# EAGLE design MSP part PCB new (EAGLE 8.6.0)
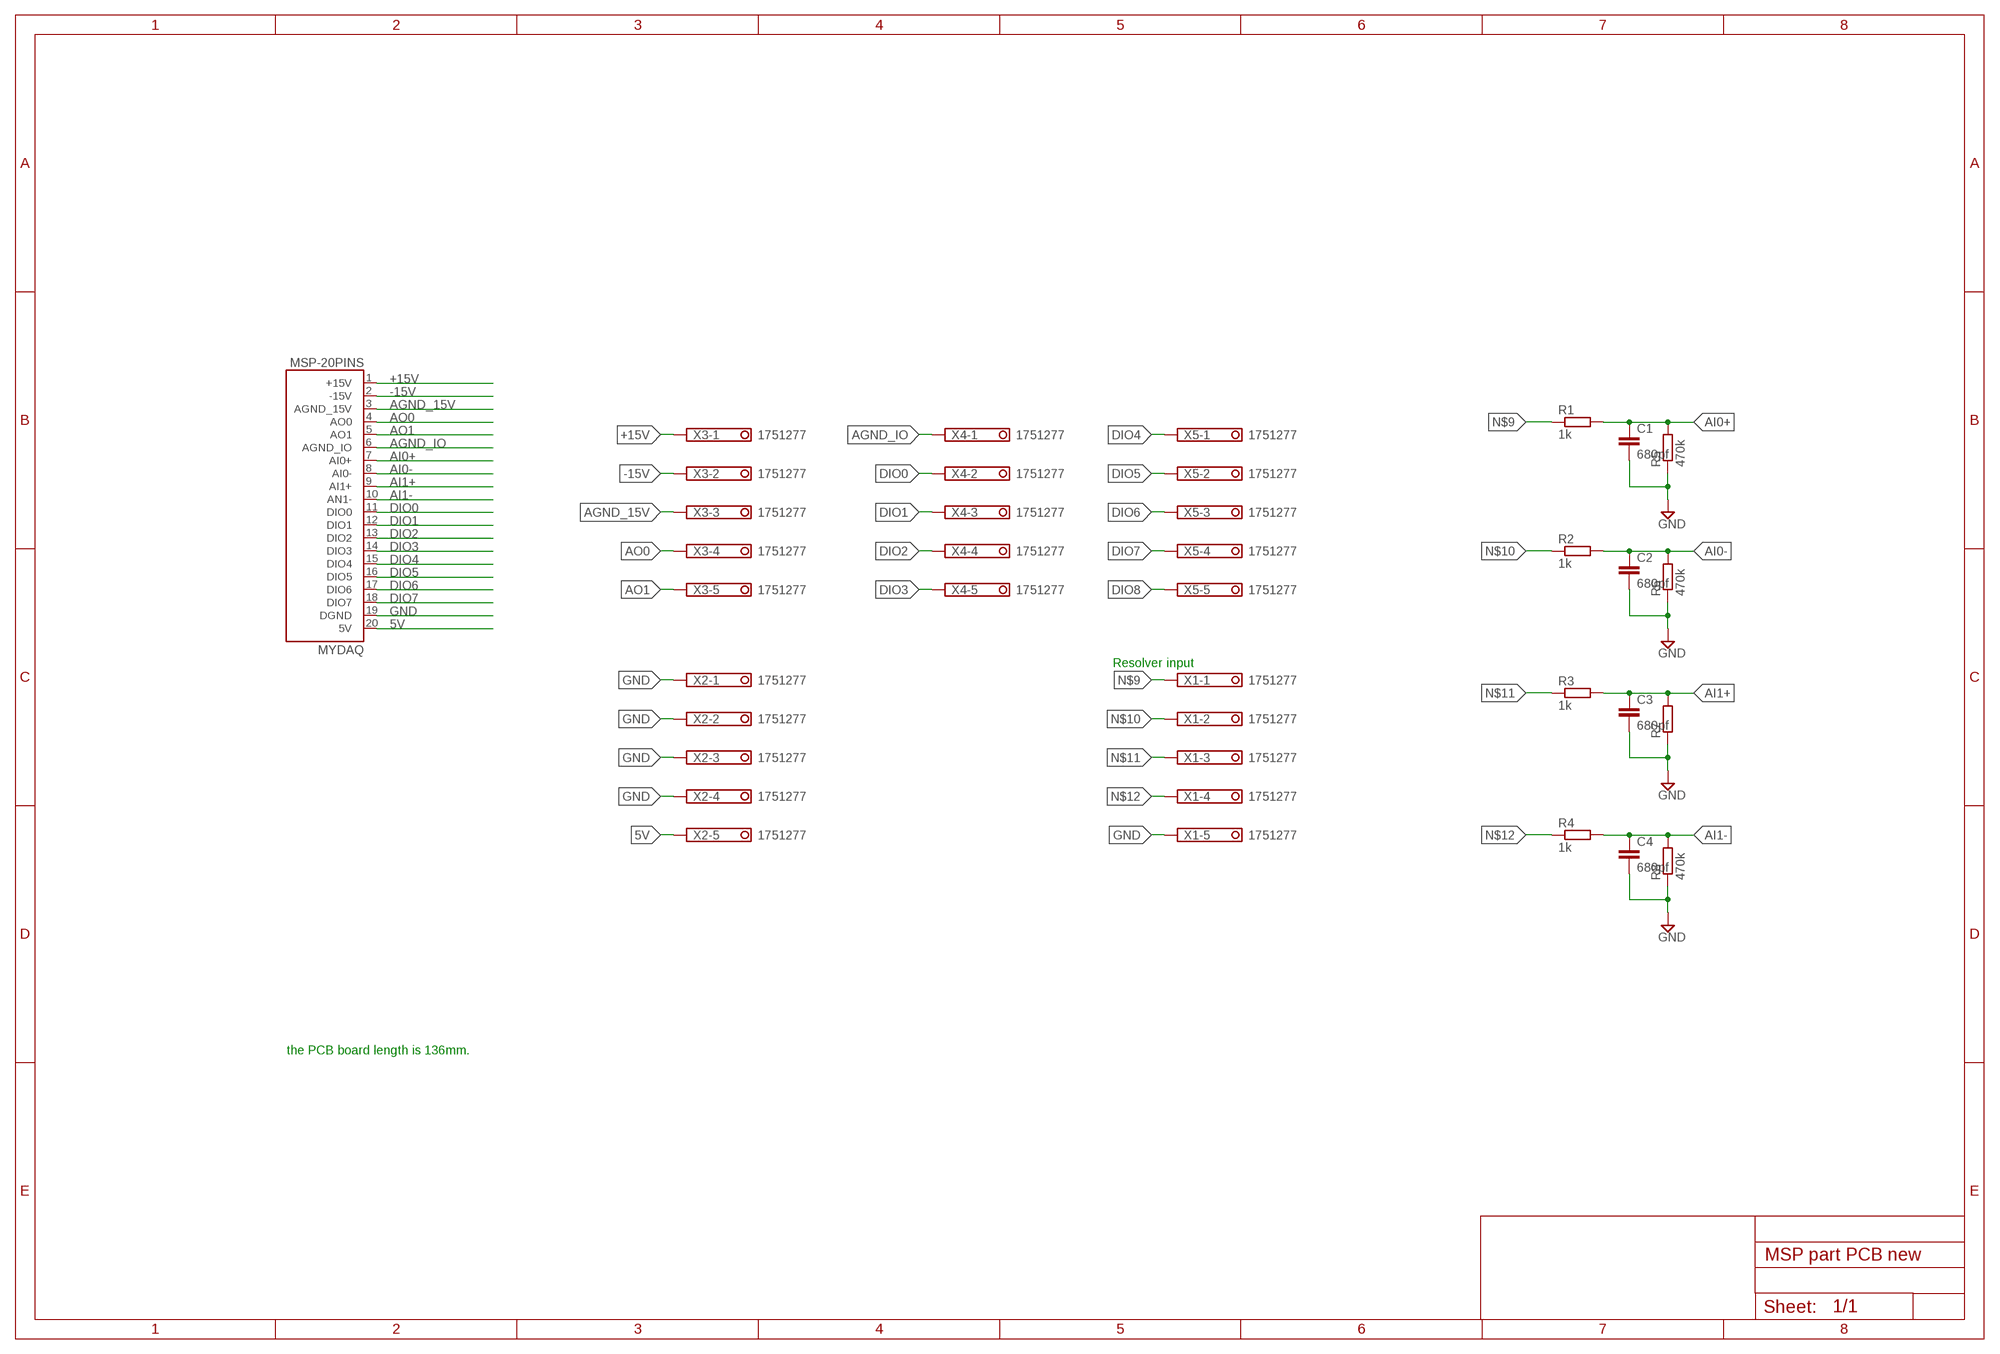
[diagram p0: schematic, sheet 1]

## Parts
C1  680pf  C-EU050-024X044  [C050-024X044]
C2  680pf  C-EU050-024X044  [C050-024X044]
C3  680pf  C-EU050-024X044  [C050-024X044]
C4  680pf  C-EU050-024X044  [C050-024X044]
MSP-20PINS  MYDAQ  [3.81MM_TERMINAL_BLOCK_FEMALE_LOCKING]
R1  1k  R-EU_0204/7  [0204/7]
R2  1k  R-EU_0204/7  [0204/7]
R3  1k  R-EU_0204/7  [0204/7]
R4  1k  R-EU_0204/7  [0204/7]
R5  470k  R-EU_0204/7  [0204/7]
R6  470k  R-EU_0204/7  [0204/7]
R7  R-EU_0204/7  [0204/7]
R8  470k  R-EU_0204/7  [0204/7]
X1  1751277  [1751277]
X2  1751277  [1751277]
X3  1751277  [1751277]
X4  1751277  [1751277]
X5  1751277  [1751277]

## Nets
5V: MSP-20PINS.20(5V) X2.5
+15V: MSP-20PINS.1(+15V) X3.1
-15V: MSP-20PINS.2(-15V) X3.2
AGND_15V: MSP-20PINS.3(AGND_15V) X3.3
AGND_IO: MSP-20PINS.6(AGND_IO) X4.1
AI0+: C1.1 MSP-20PINS.7(AI0+) R1.2 R5.2
AI0-: C2.1 MSP-20PINS.8(AI0-) R2.2 R6.2
AI1+: C3.1 MSP-20PINS.9(AI1+) R3.2 R7.2
AI1-: C4.1 MSP-20PINS.10(AN1-) R4.2 R8.2
AO0: MSP-20PINS.4(AO0) X3.4
AO1: MSP-20PINS.5(AO1) X3.5
DIO0: MSP-20PINS.11(DIO0) X4.2
DIO1: MSP-20PINS.12(DIO1) X4.3
DIO2: MSP-20PINS.13(DIO2) X4.4
DIO3: MSP-20PINS.14(DIO3) X4.5
DIO4: MSP-20PINS.15(DIO4) X5.1
DIO5: MSP-20PINS.16(DIO5) X5.2
DIO6: MSP-20PINS.17(DIO6) X5.3
DIO7: MSP-20PINS.18(DIO7) X5.4
DIO8: X5.5
GND: C1.2 C2.2 C3.2 C4.2 MSP-20PINS.19(DGND) R5.1 R6.1 R7.1 R8.1 X1.5 X2.1 X2.2 X2.3 X2.4
N$9: R1.1 X1.1
N$10: R2.1 X1.2
N$11: R3.1 X1.3
N$12: R4.1 X1.4

## Notes on the sheet
- Resolver input
- the PCB board length is 136mm.

## Library data of the parts
C1-C4 = rcl:C-EU: CAPACITOR, European symbol; SPICEPREFIX: C
MSP-20PINS = Local Lirary:MYDAQ
R1-R8 = rcl:R-EU_: RESISTOR, European symbol; SPICEPREFIX: R
X1-X5 = con-phoenix-350:1751277: MKDS 1/ 5-3,5 Printklemme Nennstrom: 10 A Bemessungsspannung: 160 V Raster: 3,5 mm Polzahl: 5 Montageart: Löten Anschlussart: Schraubanschluss Anschlussrichtung vom Leiter zur Platine: 0° Source: http://eshop.phoenixcontact.com .. 1751277.pdf; OC_FARNELL: unknown; OC_NEWARK: unknown

## Net classes
0 default: width 0.305 mm, drill 0.508 mm, clearance 0.254 mm

## Board
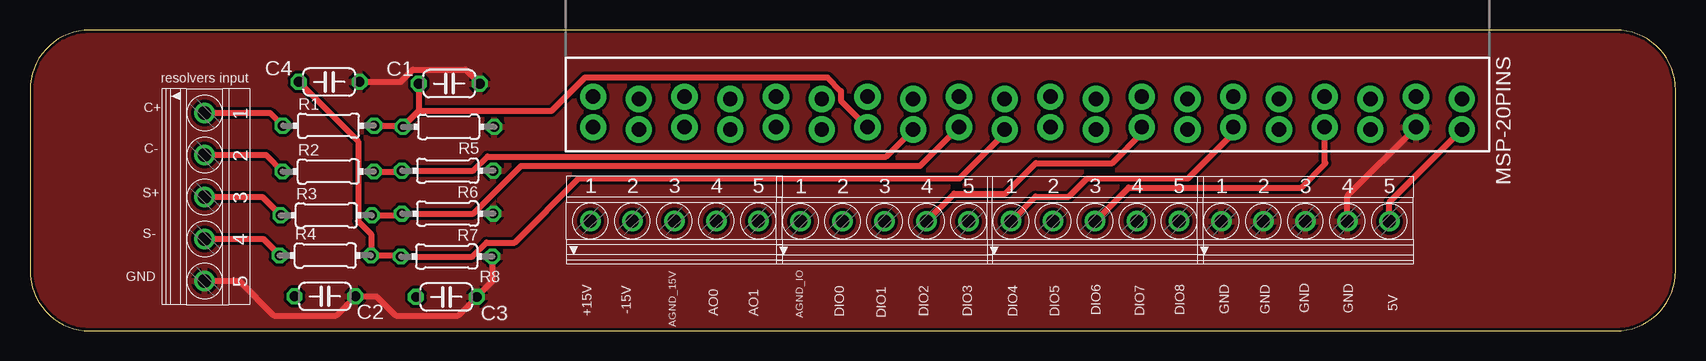
[diagram p1: board, top side]
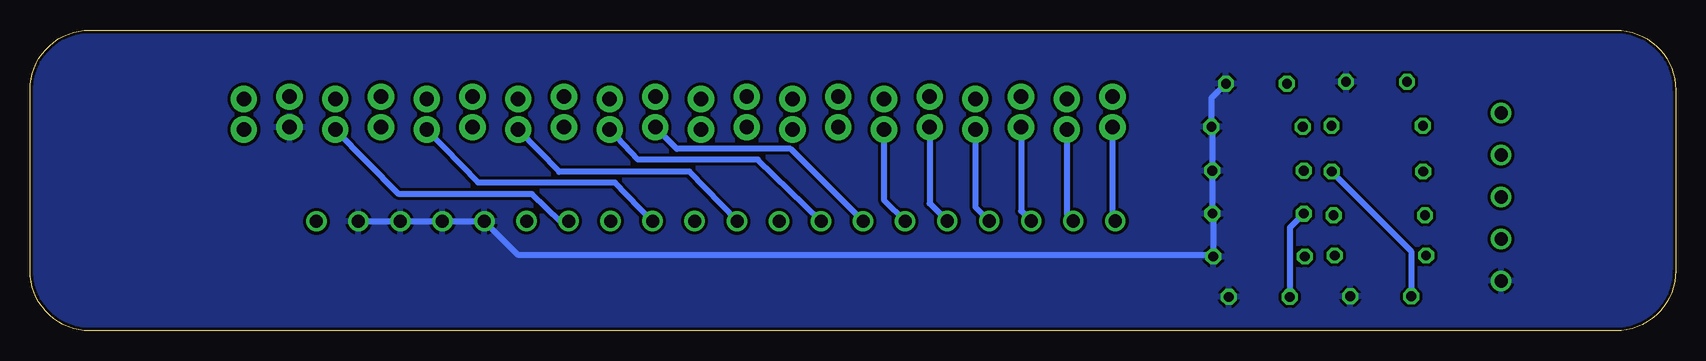
[diagram p2: board, bottom side, seen from below]

Size 137.14 x 25.07 mm. Coordinates in mm from the lower left corner, seen from the top.
Outline: 0,20.07 0,5 arc90 5,0 132.14,0 arc90 137.14,5 137.14,20.07 arc90 132.14,25.07 5,25.07 arc90 0,20.07
Copper layers (1*16): Top 0.035mm / dielectric 1.5mm / Bottom 0.035mm
Design rules "default *": minimum track width 30mil, minimum drill 0.35mm, track to track 10mil, track to pad 6mil, pad to pad 6mil, via to via 6mil, smd to smd 6mil, copper to edge 10mil, drill to drill 6mil, minimum pad ring 10mil, minimum via ring 8mil, stop-mask expansion 4mil, vias tented up to drill 0mil, thermal gap 10mil

### Footprints (pad centres in the part's own frame; a part is rotated, then mirrored left to right if it is on the bottom)
C050-024X044 = drill 0.813 octagon: 1 -2.54,0; 2 2.54,0
3.81MM_TERMINAL_BLOCK_FEMALE_LOCKING = drill 1.2 pad 2.184: 1 4.521,-36.194; 2 4.724,-32.384; 3 4.521,-28.574; 4 4.724,-24.764; 5 4.521,-20.954; 6 4.724,-17.144; 7 4.521,-13.334; 8 4.724,-9.524; 9 4.521,-5.714; 10 4.724,-1.904; 11 4.521,1.906; 12 4.724,5.716; 13 4.521,9.526; 14 4.724,13.336; 15 4.521,17.146; 16 4.724,20.956; 17 4.521,24.766; 18 4.724,28.576; 19 4.521,32.386; 20 4.724,36.196; @1 1.981,-36.194; @2 2.184,-32.384; @3 1.981,-28.574; @4 2.184,-24.764; @5 1.981,-20.954; @6 2.184,-17.144; @7 1.981,-13.334; @8 2.184,-9.524; @9 1.981,-5.714; @10 2.184,-1.904; @11 1.981,1.906; @12 2.184,5.716; @13 1.981,9.526; @14 2.184,13.336; @15 1.981,17.146; @16 2.184,20.956; @17 1.981,24.766; @18 2.184,28.576; @19 1.981,32.386; @20 2.184,36.196
0204/7 = drill 0.813 octagon: 1 -3.81,0; 2 3.81,0
1751277 = drill 1.1 pad 1.7: 1 -7,-0.1; 2 -3.5,-0.1; 3 0,-0.1; 4 3.5,-0.1; 5 7,-0.1

### Placement (x,y rotation side)
C1  34.94,20.6 0 top
C2  24.58,2.88 0 top
C3  34.7,2.83 0 top
C4  24.93,20.75 0 top
MSP-20PINS  83.12,21.5 270 top
R1  24.88,17.09 0 top
R2  24.85,13.28 0 top
R3  24.7,9.62 0 top
R4  24.61,6.28 0 top
R5  34.88,17 180 top
R6  34.8,13.34 180 top
R7  34.8,9.77 180 top
R8  34.72,6.19 180 top
X1  14.65,11.15 270 top
X2  106.28,9.23 0 top
X3  53.7,9.25 0 top
X4  71.21,9.23 0 top
X5  88.75,9.24 0 top

### Tracks (layer width: path | path; a pad name or v marks a point on that pad's centre or on a via)
5V
  Top 0.508: X2.5 113.28,10.73 MSP-20PINS.20
+15V
  Bottom 0.508: X3.1 46.93,9.38 MSP-20PINS.1
-15V
  Bottom 0.508: MSP-20PINS.2 50.74,9.69 X3.2
AGND_15V
  Bottom 0.508: MSP-20PINS.3 54.55,10 X3.3
AGND_IO
  Bottom 0.508: MSP-20PINS.6 65.98,10.9 X4.1
AI0+
  Top 0.508: R1.2 30.98,17.09 R5.2 32.4,18.33 | C1.1 32.4,18.33 | 32.4,18.33 43.47,18.33 46.27,21.12 66.44,21.12 67.58,19.98 67.58,19.19 MSP-20PINS.7
AI0-
  Top 0.508: R2.2 30.92,13.28 R6.2 36.96,13.34 38.12,14.51 71.34,14.51 MSP-20PINS.8
  Bottom 0.508: R2.2 22.04,6.65 C2.1
AI1+
  Top 0.508: R3.2 30.84,9.62 R7.2 36.95,9.77 40.94,13.75 72.39,13.75 72.84,13.75 74.18,13.75 MSP-20PINS.9
  Bottom 0.508: R7.2 32.16,8.6 C3.1
AI1-
  Top 0.508: C4.1 27.34,15.8 27.34,9.14 28.42,8.06 R4.2 30.82,6.28 R8.2 36.87,6.19 38.04,7.36 40.38,7.36 45.72,12.7 77.47,12.7 81.22,16.45 MSP-20PINS.10
AO0
  Bottom 0.508: MSP-20PINS.4 58.36,10.31 X3.4
AO1
  Bottom 0.508: MSP-20PINS.5 62.17,10.62 X3.5
DIO0
  Bottom 0.508: X4.2 73.75,15.17 83.22,15.17 MSP-20PINS.11
DIO1
  Bottom 0.508: X4.3 76.49,14.28 86.48,14.28 MSP-20PINS.12
DIO2
  Top 0.508: X4.4 77.01,11.43 81.28,11.43 83.82,13.97 90.17,13.97 92.65,16.45 MSP-20PINS.13
DIO3
  Bottom 0.508: X4.5 82.19,13.27 91.93,13.27 93.05,13.24 MSP-20PINS.14
DIO4
  Top 0.508: X5.1 83.79,11.18 86.58,11.18 88.11,12.7 96.52,12.7 100.27,16.45 MSP-20PINS.15
DIO5
  Bottom 0.508: X5.2 85.34,9.14 88.4,12.35 97.75,12.35 99.81,12.35 MSP-20PINS.16
DIO6
  Top 0.508: X5.3 91.55,11.94 105.92,11.94 107.95,13.97 107.89,14.03 MSP-20PINS.17
DIO7
  Bottom 0.508: X5.4 92.96,9.14 95.29,11.4 106.4,11.4 MSP-20PINS.18
GND
  Top 0.508: X1.5 17.44,4.15 20.32,1.27 25.51,1.27 C2.2 28.87,2.88 30.48,1.27 35.68,1.27 C3.2 38.53,4.12 R8.1 | C4.2 30.89,20.75 31.91,21.77 36.31,21.77 C1.2 | X2.4 109.78,11.24 MSP-20PINS.19
  Bottom 0.508: C1.2 38.69,19.39 R5.1 38.61,16.92 R6.1 R7.1 38.53,9.69 38.53,6.35 | 38.53,6.35 R8.1 | X2.4 X2.3 X2.2 X2.1 96.5,6.35 38.53,6.35
  pour Top: -1.27,26.67 138.43,26.67 138.43,-1.27 -1.27,-1.27
  pour Bottom: -1.27,26.67 138.43,26.67 138.43,-1.27 -1.27,-1.27
N$9
  Top 0.508: X1.1 20,18.15 R1.1
N$10
  Top 0.508: X1.2 19.67,14.65 R2.1
N$11
  Top 0.508: X1.3 19.35,11.15 R3.1
N$12
  Top 0.508: X1.4 19.42,7.65 R4.1

### Text on the board
tPlace: resolvers input | C+ | C- | S+ | S- | AGND_15V | GND | 5V | +15V | -15V | AO0 | AO1 | AGND_IO | DIO0 | DIO1 | DIO2 | DIO3 | DIO4 | DIO5 | DIO6 | DIO7 | DIO8 | GND | GND | GND | GND